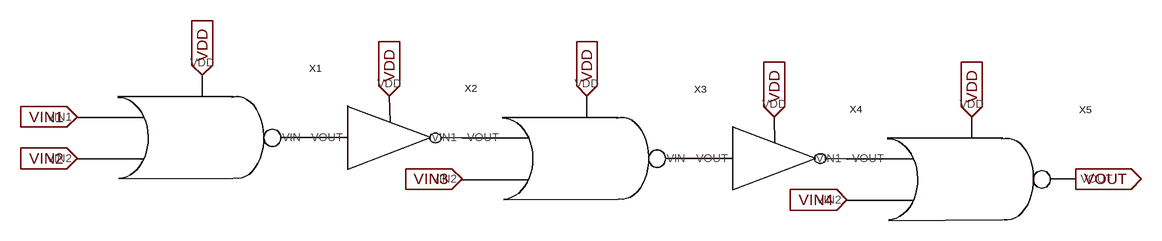
[diagram p0: schematic 4nor.asc]
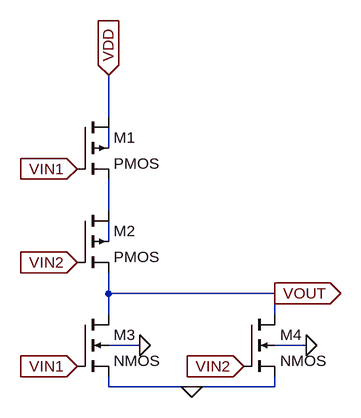
[diagram p1: sub-circuit nor.asc]
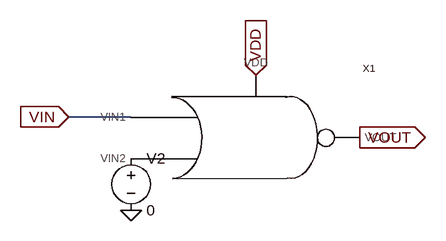
[diagram p2: sub-circuit nor-inverter.asc]
4nor.asc, the LTspice schematic file:
Version 4
SHEET 1 1628 680
FLAG 0 128 VIN1
IOPIN 0 128 In
FLAG 0 192 VIN2
IOPIN 0 192 In
FLAG 592 224 VIN3
IOPIN 592 224 In
FLAG 1184 256 VIN4
IOPIN 1184 256 In
FLAG 192 64 VDD
IOPIN 192 64 In
FLAG 784 96 VDD
IOPIN 784 96 In
FLAG 480 96 VDD
IOPIN 480 96 In
FLAG 1072 128 VDD
IOPIN 1072 128 In
FLAG 1376 128 VDD
IOPIN 1376 128 In
FLAG 1536 224 VOUT
IOPIN 1536 224 Out
SYMBOL nor 192 160 R0
SYMATTR InstName X1
SYMBOL nor-inverter 480 160 R0
SYMATTR InstName X2
SYMBOL nor 784 192 R0
SYMATTR InstName X3
SYMBOL nor-inverter 1072 192 R0
SYMATTR InstName X4
SYMBOL nor 1376 224 R0
SYMATTR InstName X5

nor.asc, the sub-circuit schematic file:
Version 4
SHEET 1 1100 680
WIRE 352 48 352 -16
WIRE 352 96 352 64
WIRE 352 192 352 144
WIRE 352 240 352 208
WIRE 352 320 352 288
WIRE 608 320 352 320
WIRE 352 352 352 320
WIRE 608 352 608 320
WIRE 400 400 352 400
WIRE 656 400 608 400
WIRE 352 464 352 448
WIRE 480 464 352 464
WIRE 608 464 608 448
WIRE 608 464 480 464
FLAG 304 128 VIN1
IOPIN 304 128 In
FLAG 304 272 VIN2
IOPIN 304 272 In
FLAG 352 -16 VDD
IOPIN 352 -16 In
FLAG 608 320 VOUT
IOPIN 608 320 Out
FLAG 400 400 0
FLAG 656 400 0
FLAG 480 464 0
FLAG 560 432 VIN2
IOPIN 560 432 In
FLAG 304 432 VIN1
IOPIN 304 432 In
SYMBOL pmos4 304 48 R0
SYMATTR InstName M1
SYMATTR Value2 l=90n w=400n
SYMBOL pmos4 304 192 R0
SYMATTR InstName M2
SYMATTR Value2 l=90n w=400n
SYMBOL nmos4 304 352 R0
SYMATTR InstName M3
SYMATTR Value2 l=90n w=200n
SYMBOL nmos4 560 352 R0
SYMATTR InstName M4
SYMATTR Value2 l=90n w=200n

nor-inverter.asc, the sub-circuit schematic file:
Version 4
SHEET 1 880 680
WIRE 96 160 0 160
FLAG 96 304 0
FLAG 0 160 VIN
IOPIN 0 160 In
FLAG 288 96 VDD
IOPIN 288 96 In
FLAG 448 192 VOUT
IOPIN 448 192 Out
SYMBOL nor 288 192 R0
SYMATTR InstName X1
SYMBOL voltage 96 208 R0
WINDOW 123 0 0 Left 0
WINDOW 39 0 0 Left 0
SYMATTR InstName V2
SYMATTR Value 0

The netlist it stands for:
* 4nor.asc
XX1 VIN1 VIN2 VDD P001 nor
XX2 P001 P002 VDD nor-inverter
XX3 P002 VIN3 VDD P003 nor
XX4 P003 P004 VDD nor-inverter
XX5 P004 VIN4 VDD VOUT nor

* block symbol definitions
.subckt nor VIN1 VIN2 VDD VOUT
M1 VDD VIN1 N002 N001 PMOS l=90n w=400n
M2 N002 VIN2 VOUT N003 PMOS l=90n w=400n
M3 VOUT VIN1 0 0 NMOS l=90n w=200n
M4 VOUT VIN2 0 0 NMOS l=90n w=200n
.ends nor

.subckt nor-inverter VIN VOUT VDD
XX1 VIN P001 VDD VOUT nor
V2 P001 0 0
.ends nor-inverter

.model NMOS NMOS
.model PMOS PMOS
.lib standard.mos
.backanno
.end